# Altium schematic sheet shieldMegaEstacionTT.SchDoc
size A3
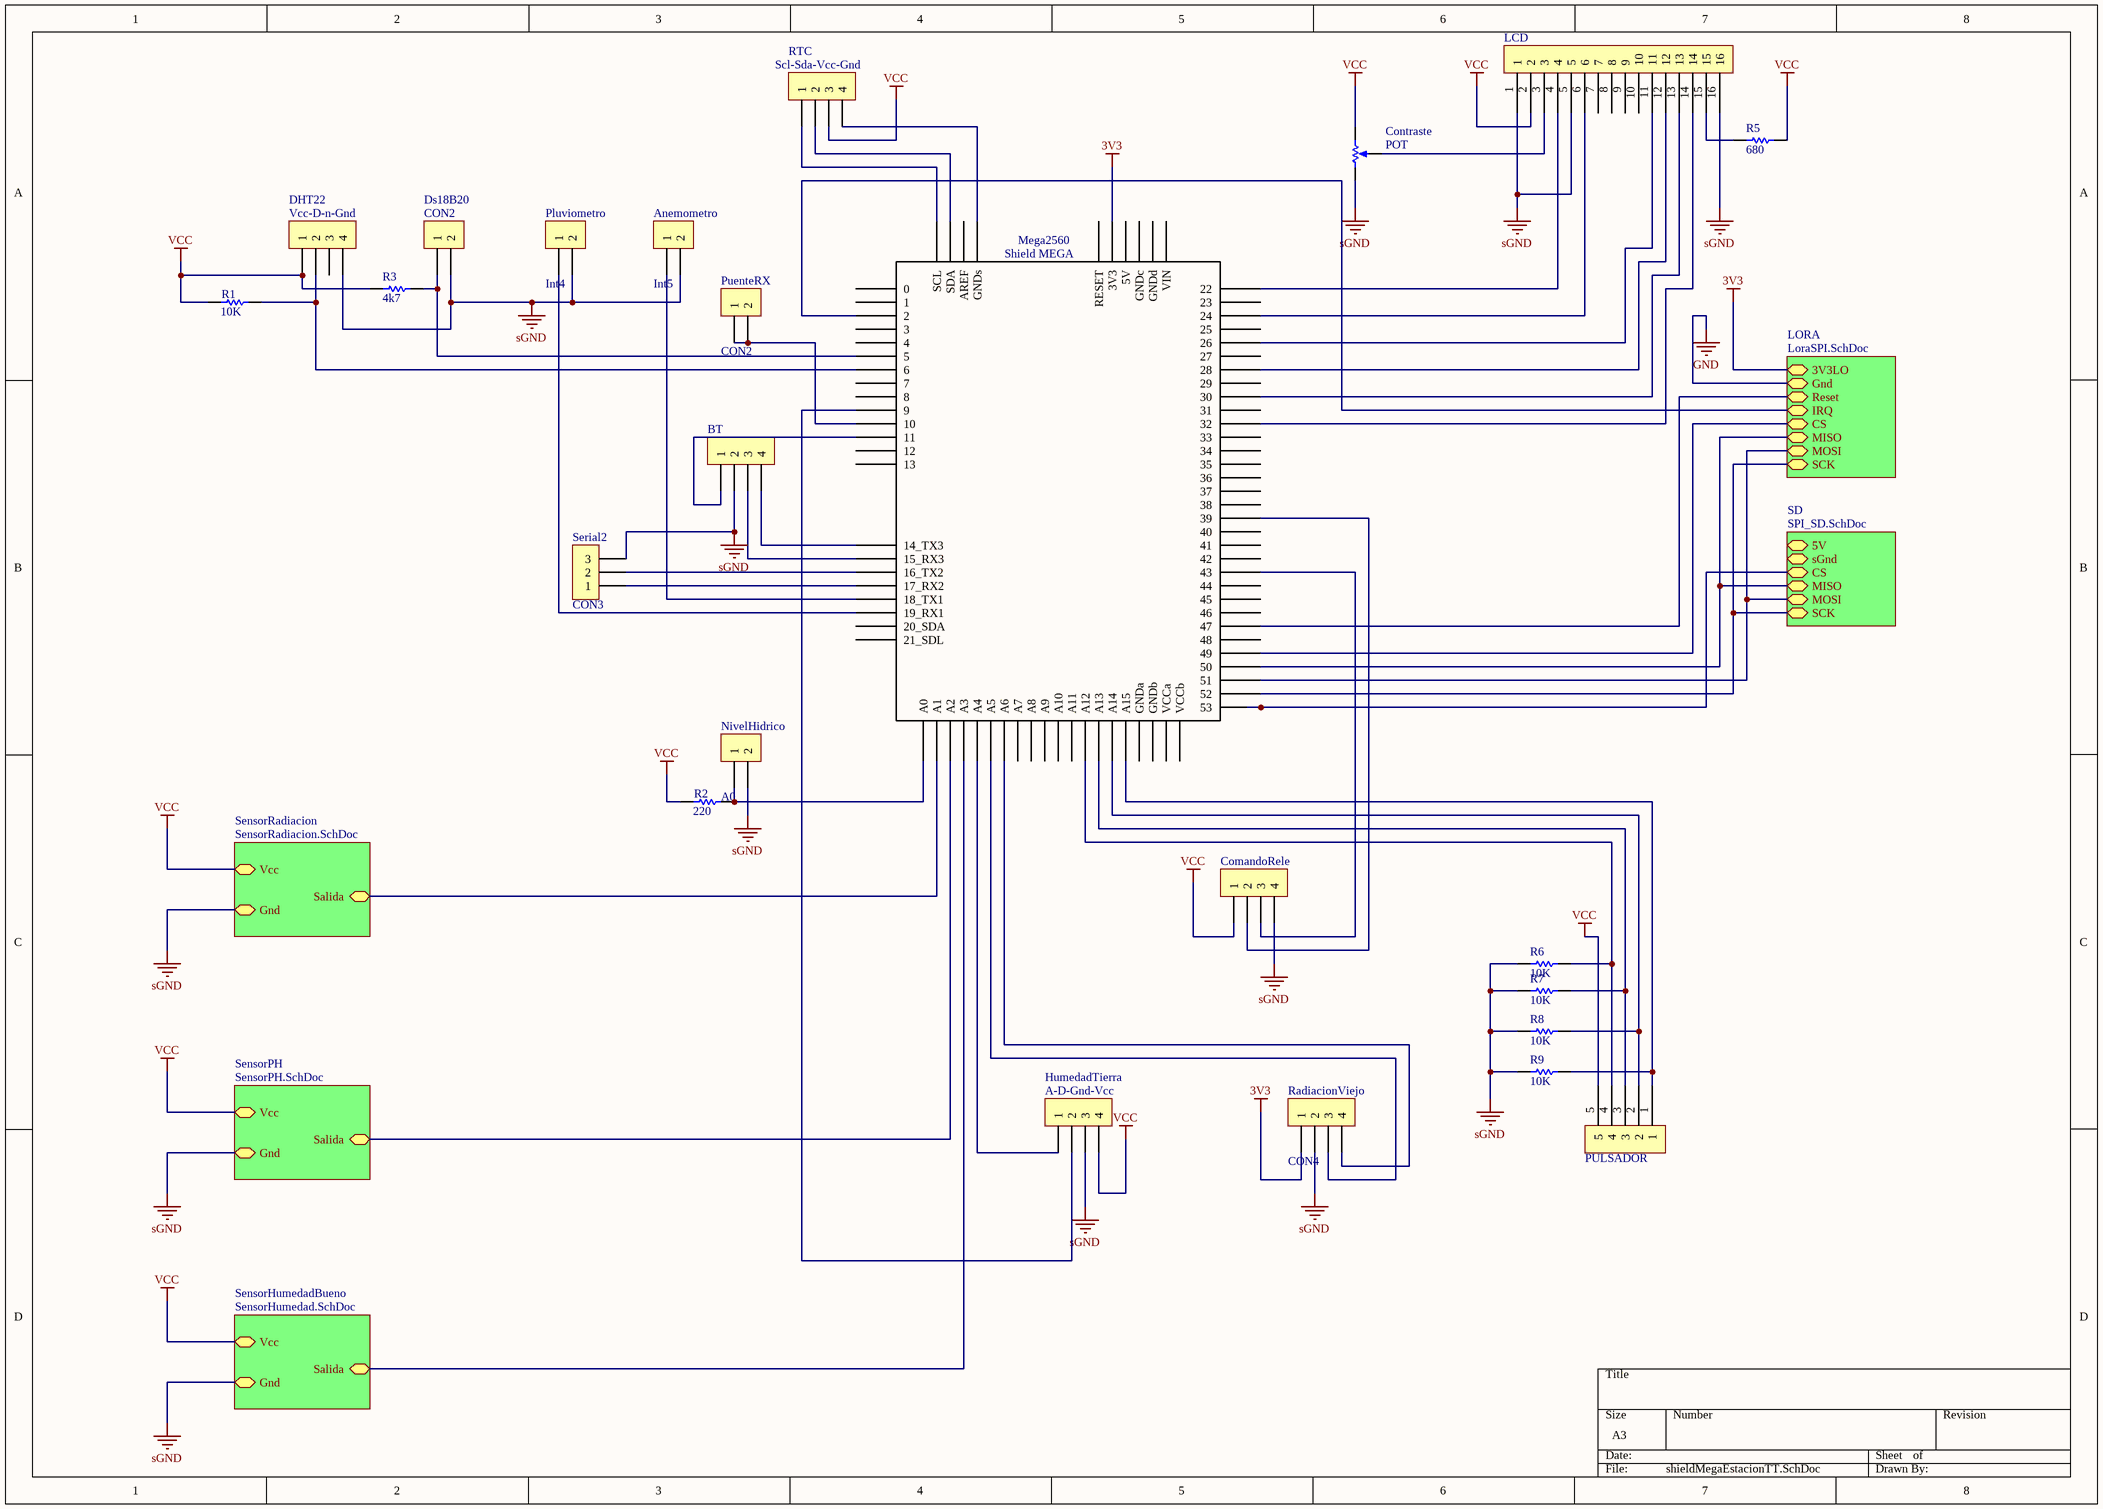
[diagram p0: shieldMegaEstacionTT.SchDoc]

## Parts
Anemometro  Int5  [BORNERA2 - T]
BT  CON4  [CON4]  (value not drawn)
ComandoRele  CON4  [CON4]  (value not drawn)
Contraste  POT  [PRESET2]
DHT22  Vcc-D-n-Gnd  [BORNERA4]
Ds18B20  CON2  [BORNERA2 - T]
HumedadTierra  A-D-Gnd-Vcc  [CON4]
LCD  CON16  [CON2X8]  (value not drawn)
Mega2560  Shield MEGA  [Shield Mega]
NivelHidrico  A0  [BORNERA2 - T]
Pluviometro  Int4  [BORNERA2 - T]
PuenteRX  CON2  [CON2]
PULSADOR  CON5  [CON5]  (value not drawn)
R1  10K  [RES300]
R2  220  [RES300]
R3  4k7  [RES300]
R5  680  [RES300]
R6  10K  [RES300]
R7  10K  [RES300]
R8  10K  [RES300]
R9  10K  [RES300]
RadiacionViejo  CON4  [BORNERA4 - T]
RTC  Scl-Sda-Vcc-Gnd  [CON4]
Serial2  CON3  [CON3]

## Sub-sheets
LORA = LoraSPI.SchDoc: 3V3LO (bidir), Gnd, Reset, IRQ, CS, MISO, MOSI, SCK
SD = SPI_SD.SchDoc: 5V, sGnd, CS, MISO, MOSI, SCK
SensorHumedadBueno = SensorHumedad.SchDoc: Vcc, Gnd, Salida
SensorPH = SensorPH.SchDoc: Vcc, Gnd, Salida
SensorRadiacion = SensorRadiacion.SchDoc: Vcc, Gnd, Salida

## Nets
3V3: Mega2560.3V3 RadiacionViejo.1 ; sheet LORA/3V3LO
GND: sheet LORA/Gnd
sGND: Anemometro.2 BT.2 ComandoRele.4 Contraste.2 DHT22.4 Ds18B20.2 HumedadTierra.3 LCD.1 LCD.5 LCD.16 NivelHidrico.2 Pluviometro.2 R6.1 R7.1 R8.1 R9.1 RadiacionViejo.2 Serial2.3 ; sheet SensorRadiacion/Gnd, sheet SensorPH/Gnd, sheet SensorHumedadBueno/Gnd
VCC: ComandoRele.1 Contraste.1 DHT22.1 HumedadTierra.4 LCD.2 PULSADOR.5 R1.1 R2.1 R3.1 R5.1 RTC.3 ; sheet SensorRadiacion/Vcc, sheet SensorPH/Vcc, sheet SensorHumedadBueno/Vcc
NetAnemometro_1: Anemometro.1 Mega2560.18(18_TX1)
NetBT_1: BT.1 Mega2560.11
NetBT_3: BT.3 Mega2560.15(15_RX3)
NetBT_4: BT.4 Mega2560.14(14_TX3)
NetComandoRele_2: ComandoRele.2 Mega2560.39
NetComandoRele_3: ComandoRele.3 Mega2560.43
NetContraste_3: Contraste.3 LCD.3
NetDHT22_2: DHT22.2 Mega2560.6 R1.2
NetDs18B20_1: Ds18B20.1 Mega2560.5 R3.2
NetHumedadTierra_1: HumedadTierra.1 Mega2560.A4
NetHumedadTierra_2: HumedadTierra.2 Mega2560.9
NetLCD_4: LCD.4 Mega2560.22
NetLCD_6: LCD.6 Mega2560.24
NetLCD_11: LCD.11 Mega2560.26
NetLCD_12: LCD.12 Mega2560.28
NetLCD_13: LCD.13 Mega2560.30
NetLCD_14: LCD.14 Mega2560.32
NetLCD_15: LCD.15 R5.2
NetMega2560_2: Mega2560.2 ; sheet LORA/IRQ
NetMega2560_10: Mega2560.10 PuenteRX.1 PuenteRX.2
NetMega2560_16: Mega2560.16(16_TX2) Serial2.2
NetMega2560_17: Mega2560.17(17_RX2) Serial2.1
NetMega2560_19: Mega2560.19(19_RX1) Pluviometro.1
NetMega2560_47: Mega2560.47 ; sheet LORA/Reset
NetMega2560_49: Mega2560.49 ; sheet LORA/CS
NetMega2560_50: Mega2560.50 ; sheet LORA/MISO, sheet SD/MISO
NetMega2560_51: Mega2560.51 ; sheet LORA/MOSI, sheet SD/MOSI
NetMega2560_52: Mega2560.52 ; sheet LORA/SCK, sheet SD/SCK
NetMega2560_53: Mega2560.53 ; sheet SD/CS
NetMega2560_A0: Mega2560.A0 NivelHidrico.1 R2.2
NetMega2560_A1: Mega2560.A1 ; sheet SensorRadiacion/Salida
NetMega2560_A2: Mega2560.A2 ; sheet SensorPH/Salida
NetMega2560_A3: Mega2560.A3 ; sheet SensorHumedadBueno/Salida
NetMega2560_A5: Mega2560.A5 RadiacionViejo.3
NetMega2560_A6: Mega2560.A6 RadiacionViejo.4
NetMega2560_A12: Mega2560.A12 PULSADOR.4 R6.2
NetMega2560_A13: Mega2560.A13 PULSADOR.3 R7.2
NetMega2560_A14: Mega2560.A14 PULSADOR.2 R8.2
NetMega2560_A15: Mega2560.A15 PULSADOR.1 R9.2
NetMega2560_GNDs: Mega2560.GNDs RTC.4
NetMega2560_SCL: Mega2560.SCL RTC.1
NetMega2560_SDA: Mega2560.SDA RTC.2

Not connected (* = marked no-connect by the designer): DHT22 3; LCD 7 8 9 10; Mega2560 0 1 3 4 5V 7 8 12 13 20(20_SDA) 21(21_SDL) 23 25 27 29 31 33 34 35 36 37 38 40 41 42 44 45 46 48 A7 A8 A9 A10 A11 AREF GNDa GNDb GNDc GNDd RESET VCCa VCCb VIN

## Library data of the parts
Anemometro Ds18B20 NivelHidrico Pluviometro PuenteRX = CON2: Conector 2
BT ComandoRele DHT22 HumedadTierra RadiacionViejo RTC = CON4: Conector 4
Contraste = POT: Potenciometro - Preset
LCD = CON16: Conector 16
PULSADOR = CON5: Conector 5
R1-R3 R5-R9 = RES: Resistencia
Serial2 = CON3: Conector 3